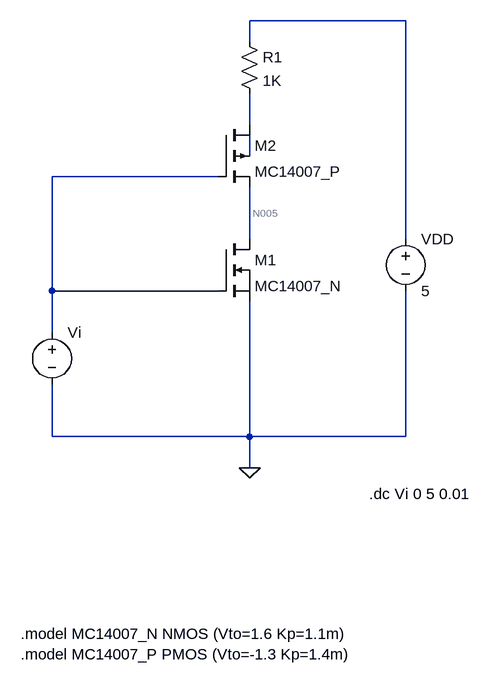
[diagram p0: schematic 131.asc]
131.asc, the LTspice schematic file:
Version 4.1
SHEET 1 880 680
WIRE 608 -336 368 -336
WIRE 368 -304 368 -336
WIRE 368 -176 368 -224
WIRE 368 -128 368 -160
WIRE 320 -96 64 -96
WIRE 368 0 368 -80
WIRE 608 0 608 -336
WIRE 64 80 64 -96
WIRE 320 80 64 80
WIRE 64 144 64 80
WIRE 64 304 64 224
WIRE 368 304 368 96
WIRE 368 304 64 304
WIRE 608 304 608 80
WIRE 608 304 368 304
WIRE 368 352 368 304
FLAG 368 352 0
SYMBOL voltage 64 128 R0
WINDOW 123 0 0 Left 0
WINDOW 39 0 0 Left 0
WINDOW 3 24 44 Left 2
SYMATTR InstName Vi
SYMATTR Value ""
SYMBOL voltage 608 -16 R0
WINDOW 123 0 0 Left 0
WINDOW 39 0 0 Left 0
SYMATTR InstName VDD
SYMATTR Value 5
SYMBOL nmos 320 0 R0
SYMATTR InstName M1
SYMATTR Value MC14007_N
SYMBOL res 352 -320 R0
SYMATTR InstName R1
SYMATTR Value 1K
SYMBOL pmos4 320 -176 R0
SYMATTR InstName M2
SYMATTR Value MC14007_P
TEXT 16 608 Left 2 !.model MC14007_N NMOS (Vto=1.6 Kp=1.1m)\n.model MC14007_P PMOS (Vto=-1.3 Kp=1.4m)
TEXT 552 392 Left 2 !.dc Vi 0 5 0.01

The netlist it stands for:
* 131.asc
Vi N004 0
VDD N001 0 5
M1 N005 N004 0 0 MC14007_N
R1 N001 N002 1K
M2 N002 N004 N005 N003 MC14007_P
.model NMOS NMOS
.model PMOS PMOS
.lib standard.mos
.model MC14007_N NMOS (Vto=1.6 Kp=1.1m)
.model MC14007_P PMOS (Vto=-1.3 Kp=1.4m)
.dc Vi 0 5 0.01
.backanno
.end

* Results of the author's LTspice run, read from the files saved beside the schematic
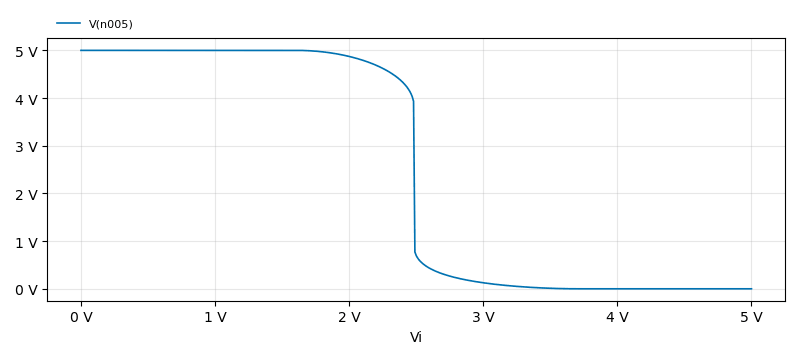
[diagram p1: DC transfer characteristic of 131.asc, plotted from the saved traces]
* DC transfer characteristic, 1 run:
*   V(n005): 5 V at Vi=0 V, 2.629 nV at Vi=5 V, min 2.629 nV, max 5 V